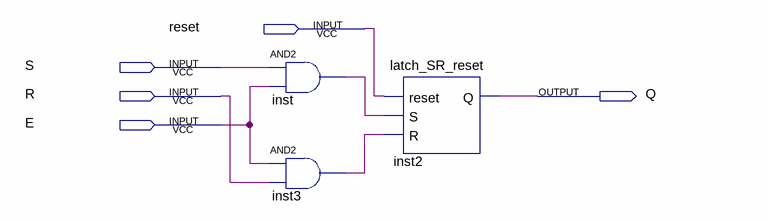
[diagram p0: schematic sheet]
// Quartus schematic latch_SR_E_sr.bdf as structural Verilog: 3 symbols, 5 pins
module latch_SR_E_sr (
  input  reset,
  input  S,
  input  R,
  input  E,
  output Q
);

  wire inst3_out, inst_out;

  and inst (inst_out, S, E);
  and inst3 (inst3_out, E, R);
  latch_SR_reset inst2 (.reset(reset), .S(inst_out), .R(inst3_out), .Q(Q));
endmodule
